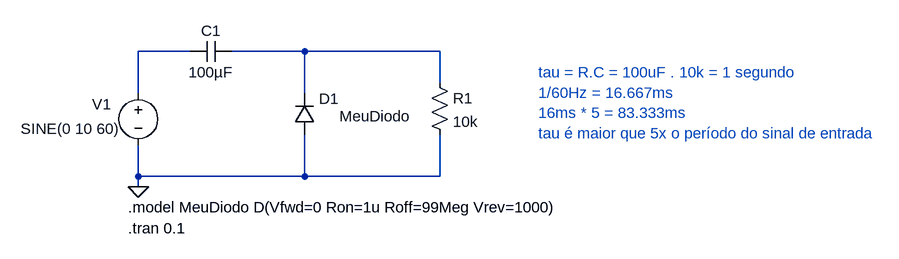
[diagram p0: schematic Diodo-Grampeador-LTSpice.asc]
Diodo-Grampeador-LTSpice.asc, the LTspice schematic file:
Version 4
SHEET 1 1168 680
WIRE 64 32 -16 32
WIRE 240 32 128 32
WIRE 448 32 240 32
WIRE 448 80 448 32
WIRE -16 96 -16 32
WIRE 240 96 240 32
WIRE -16 224 -16 176
WIRE 240 224 240 160
WIRE 240 224 -16 224
WIRE 448 224 448 160
WIRE 448 224 240 224
WIRE -16 240 -16 224
FLAG -16 240 0
SYMBOL voltage -16 80 R0
WINDOW 123 0 0 Left 2
WINDOW 39 0 0 Left 2
WINDOW 0 -71 33 Left 2
WINDOW 3 -181 71 Left 2
SYMATTR InstName V1
SYMATTR Value SINE(0 10 60)
SYMBOL diode 256 160 R180
WINDOW 0 -37 55 Left 2
WINDOW 3 -148 28 Left 2
SYMATTR InstName D1
SYMATTR Value MeuDiodo
SYMBOL cap 128 16 R90
WINDOW 0 0 32 VBottom 2
WINDOW 3 32 32 VTop 2
SYMATTR InstName C1
SYMATTR Value 100µF
SYMBOL res 432 64 R0
SYMATTR InstName R1
SYMATTR Value 10k
TEXT -32 304 Left 2 !.tran 0.1
TEXT -32 272 Left 2 !.model MeuDiodo D(Vfwd=0 Ron=1u Roff=99Meg Vrev=1000)
TEXT 600 64 Left 2 ;tau = R.C = 100uF . 10k = 1 segundo\n1/60Hz = 16.667ms\n16ms * 5 = 83.333ms\ntau é maior que 5x o período do sinal de entrada

The netlist it stands for:
* Diodo-Grampeador-LTSpice.asc
V1 N001 0 SINE(0 10 60)
D1 0 N002 MeuDiodo
C1 N002 N001 100µF
R1 N002 0 10k
.model D D
.lib standard.dio
.tran 0.1
.model MeuDiodo D(Vfwd=0 Ron=1u Roff=99Meg Vrev=1000)
* tau = R.C = 100uF . 10k = 1 segundo
* 1/60Hz = 16.667ms
* 16ms * 5 = 83.333ms
* tau é maior que 5x o período do sinal de entrada
.backanno
.end